# Altium project BGT60LTR11AIP_Shield_V2.0.PrjPcb
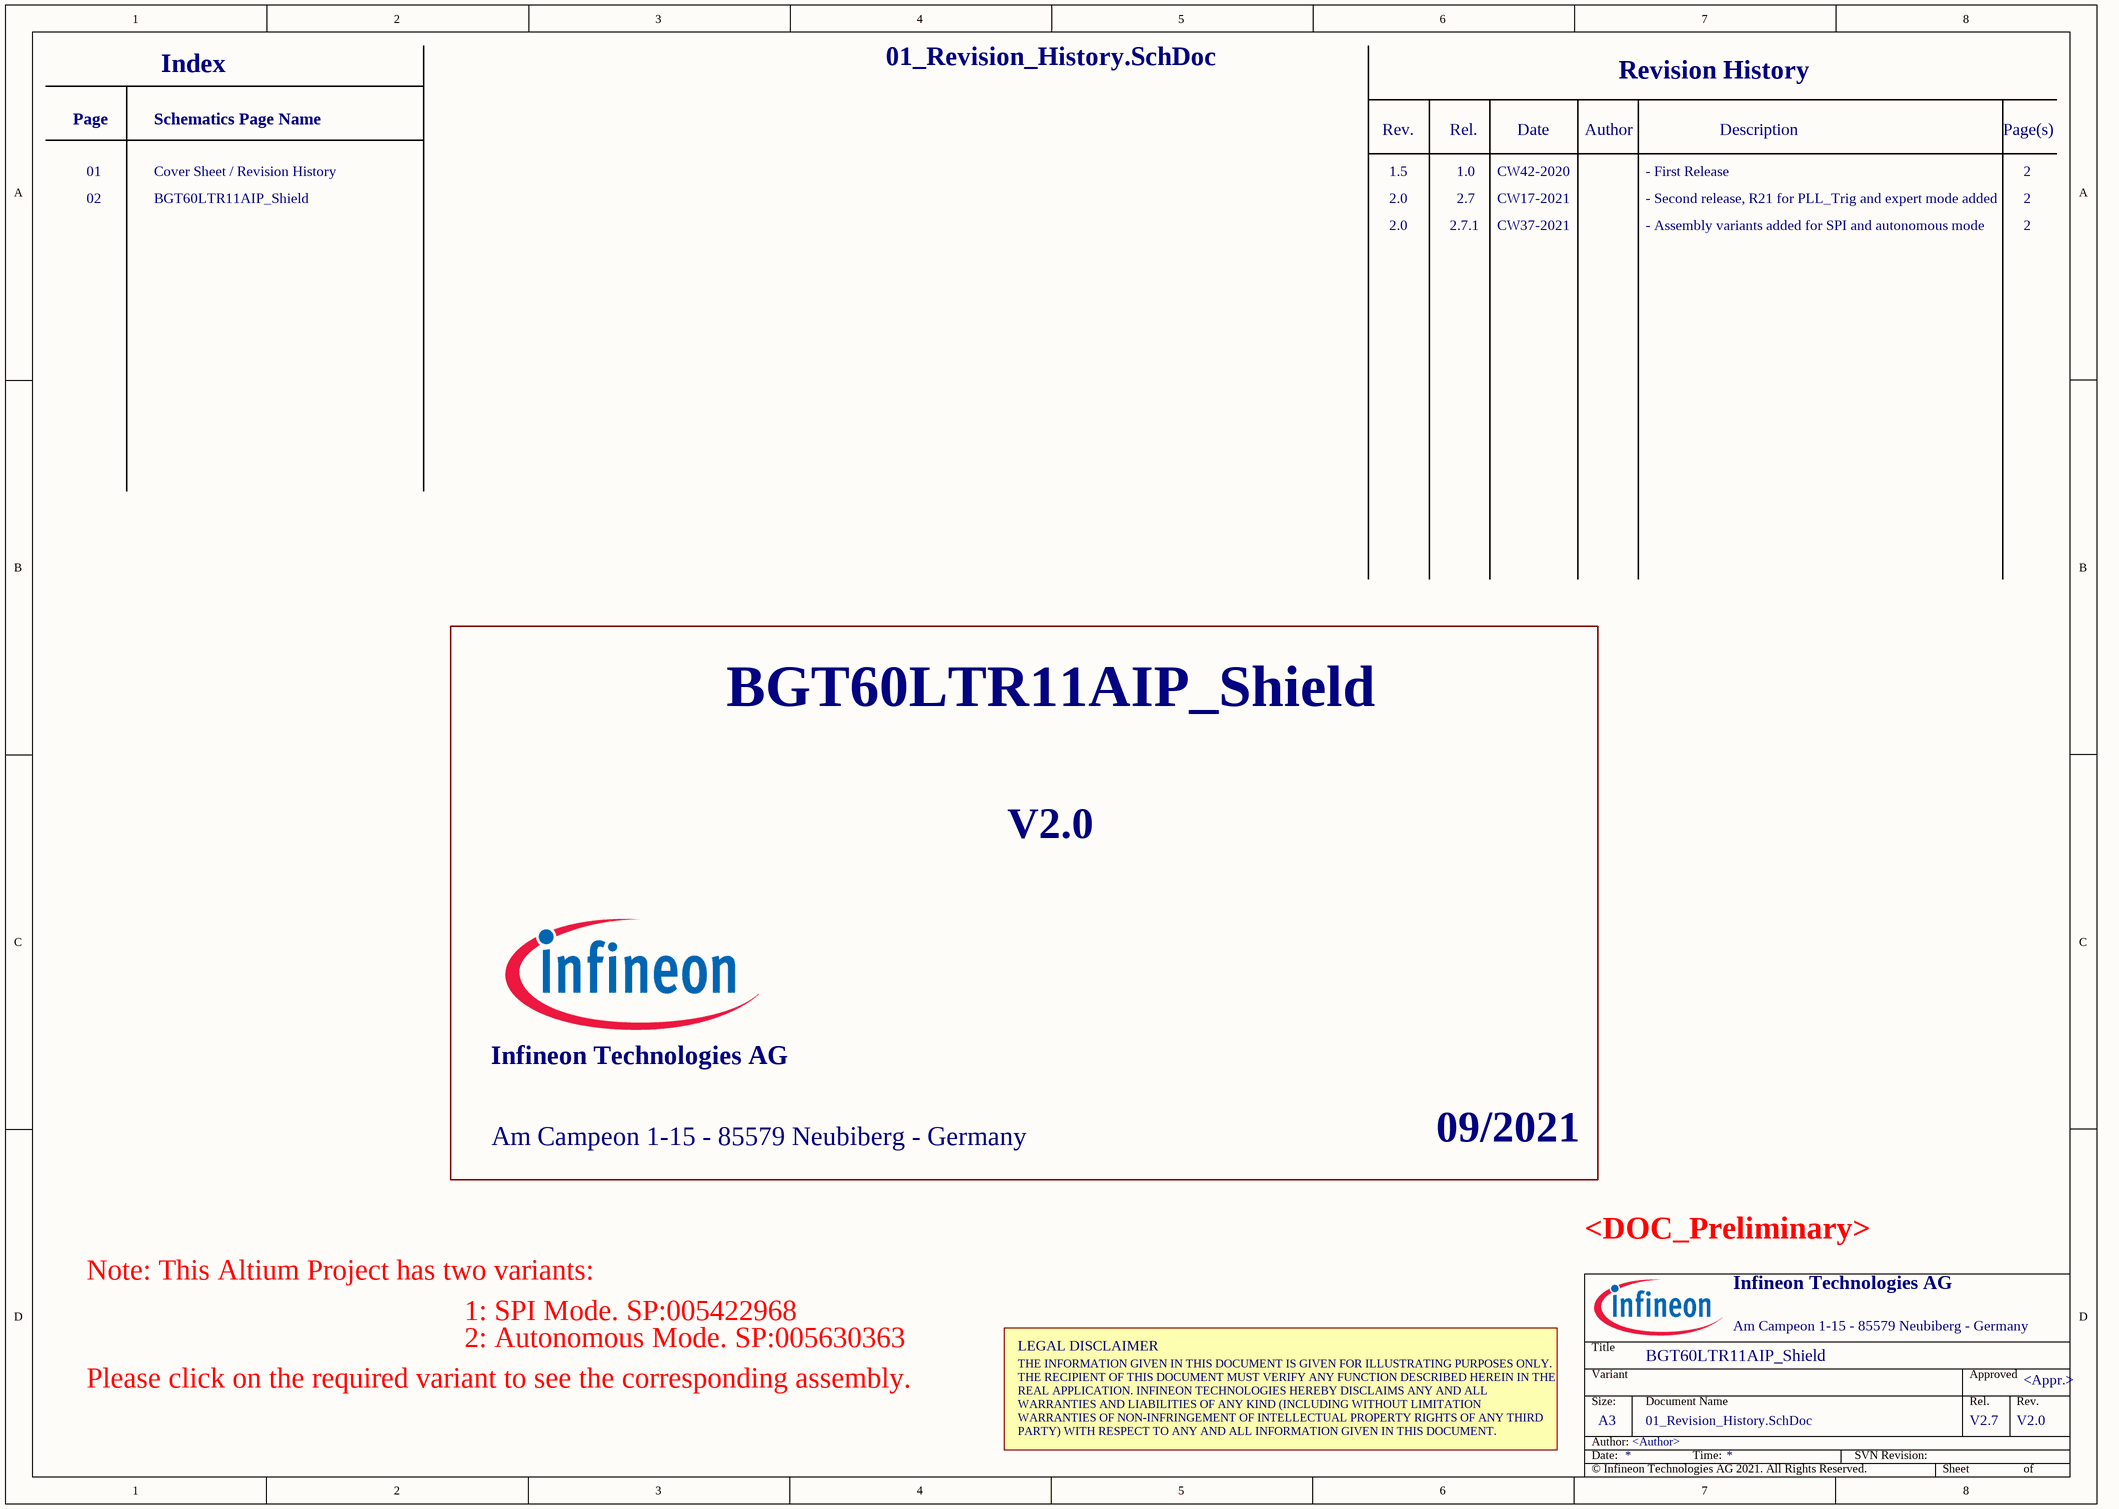
[diagram p0: 01_Revision_History.SchDoc]
PRJ_Address2: Am Campeon 1-15 - 85579 Neubiberg - Germany; PRJ_Copyright: © Infineon Technologies AG 2021. All Rights Reserved.; PRJ_Engineer: V2.7; PRJ_Organization: Infineon Technologies AG; PRJ_PCB_Release: V2.0; PRJ_PCB_Revision: V2.0; PRJ_PCBApprovedBy: <Appr.>; PRJ_PCBDesigner: <PCB Designer>; PRJ_Preliminary: <DOC_Preliminary>; PRJ_Release: V2.7.1; PRJ_Responsible: <Project Responsible>; PRJ_Revision: <Rev.>; PRJ_SCH_Author: <Author>; PRJ_SCH_Revision: V2.0; PRJ_Title: BGT60LTR11AIP_Shield; PRJ_Year: 09/2021
2 sheets, 64 parts. Net scope: global (net labels, ports and power ports of the same name join across sheets).
Board file: BGT60LTR11AIP_Shield_V2.0.PcbDoc
Sheets:
  01_Revision_History.SchDoc
  02_BGT60LTR11AIP_Shield.SchDoc

## Sheet 01_Revision_History.SchDoc: <Project Name>
size A3; ApprovedBy: <Appr.>; Author: <Author>; CompanyName: Infineon Technologies AG; Engineer: <Rel.>; Organization: Infineon Technologies AG; Address1: COM AC SDC SD3; Address2: Am Campeon 1-12  -  85579 Neubiberg  -  Germany; Address3: 85579 Neubiberg; Address4: Germany; Revision: <Rev.>; Release: RC00; PageSetup: Record=PageOptions|CenterHorizontal=True|CenterVertical=True|PrintScale=1.01|XCorrection=1.00|YCorrection=1.00|PrintKind=0|BorderSize=5000000|LeftOffset=0|BottomOffset=0|Orientation=2|PaperLength=1000|PaperWidth=1000|Scale=100|PaperSource=7|PrintQuality=-4|MediaType=1|DitherType=10|PaperKind=A3|PrintScaleMode=1; Doc_ConfidentialStatus: <Doc_ConfidentialStatus>; Doc_Preliminary: <Doc_Preliminary>

### Notes on the sheet
- Index
- Revision History
- Page
- 01
- Cover Sheet / Revision History
- Schematics Page Name
- Rev.
- 1.5
- Rel.
- 1.0
- CW42-2020
- Date
- Author
- - First Release
- Description
- Page(s)
- 2
- 02
- BGT60LTR11AIP_Shield
- 2.0
- 2.7.1
- 2.7
- CW17-2021
- CW37-2021
- - Second release, R21 for PLL_Trig and expert mode added
- - Assembly variants added for SPI and autonomous mode
- Note: This Altium Project has two variants:
- 1: SPI Mode. SP:005422968
- Please click on the required variant to see the corresponding assembly.
- 2: Autonomous Mode. SP:005630363
- LEGAL DISCLAIMER
- THE INFORMATION GIVEN IN THIS DOCUMENT IS GIVEN FOR ILLUSTRATING PURPOSES ONLY.
  THE RECIPIENT OF THIS DOCUMENT MUST VERIFY ANY FUNCTION DESCRIBED HEREIN IN THE
  REAL APPLICATION. INFINEON TECHNOLOGIES HEREBY DISCLAIMS ANY AND ALL
  WARRANTIES AND LIABILITIES OF ANY KIND (INCLUDING WITHOUT LIMITATION
  WARRANTIES OF NON-INFRINGEMENT OF INTELLECTUAL PROPERTY RIGHTS OF ANY THIRD
  PARTY) WITH RESPECT TO ANY AND ALL INFORMATION GIVEN IN THIS DOCUMENT.
- Title
- Variant
- Approved
- Date:
- Author:
- Size:
- A3
- Document Name
- Time:
- SVN Revision:
- Sheet
- of

## Sheet 02_BGT60LTR11AIP_Shield.SchDoc: <Project Name>
size A3; ApprovedBy: <Appr.>; Author: <Author>; CompanyName: Infineon Technologies AG; Engineer: <Rel.>; Organization: Infineon Technologies AG; Address1: COM AC SDC SD3; Address2: Am Campeon 1-12  -  85579 Neubiberg  -  Germany; Address3: 85579 Neubiberg; Address4: Germany; Revision: <Rev.>; Release: RC00; PageSetup: Record=PageOptions|CenterHorizontal=True|CenterVertical=True|PrintScale=1.01|XCorrection=1.00|YCorrection=1.00|PrintKind=0|BorderSize=5000000|LeftOffset=0|BottomOffset=0|Orientation=2|PaperLength=1000|PaperWidth=1000|Scale=100|PaperSource=7|PrintQuality=-4|MediaType=1|DitherType=10|PaperKind=A3|PrintScaleMode=1; Doc_ConfidentialStatus: <Doc_ConfidentialStatus>; Doc_Preliminary: <Doc_Preliminary>
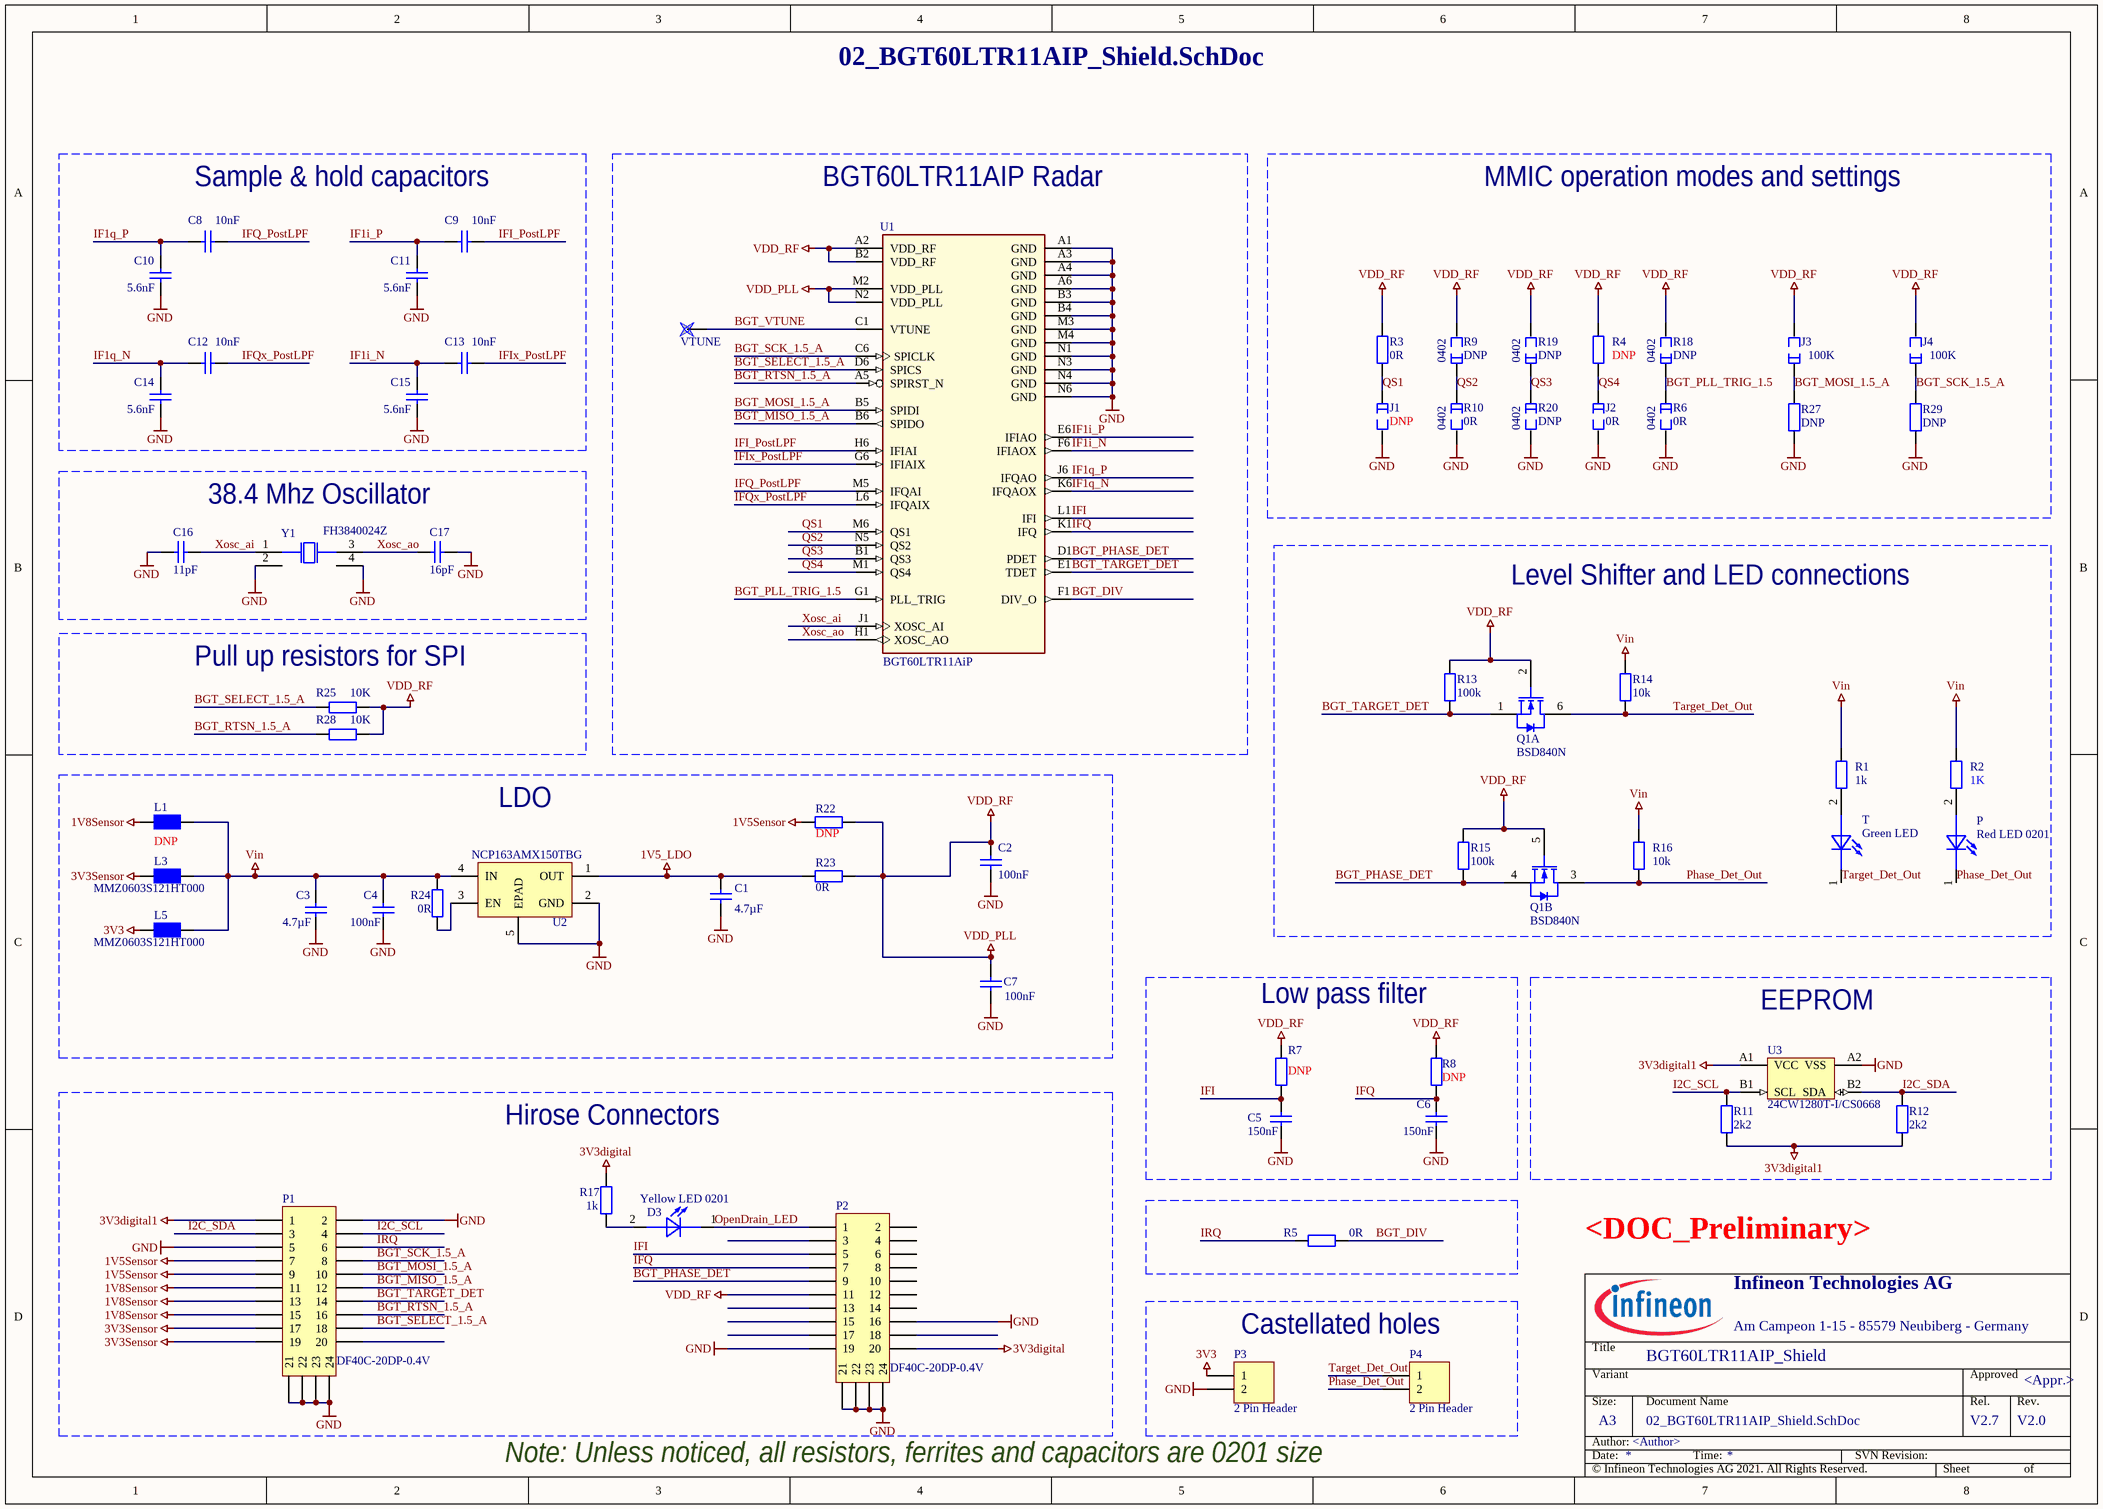
[diagram p1: 02_BGT60LTR11AIP_Shield.SchDoc]

### Parts
C1  4.7µF  [C_0201]
C2  100nF  [C_0201]
C3  4.7µF  [C_0201]
C4  100nF  [C_0201]
C5  150nF  [C_0201]
C6  150nF  [C_0201]
C7  100nF  [C_0201]
C8  10nF  [C_0201]
C9  10nF  [C_0201]
C10  5.6nF  [C_0201]
C11  5.6nF  [C_0201]
C12  10nF  [C_0201]
C13  10nF  [C_0201]
C14  5.6nF  [C_0201]
C15  5.6nF  [C_0201]
C16  11pF  [C_0201]
C17  16pF  [C_0201]
D3  Yellow LED 0201  [LED_0201]
J1  DNP  [QS_Jumper]
J2  0R  [QS_Jumper]
J3  100K  [QS_Jumper]
J4  100K  [QS_Jumper]
L1  DNP  [R_0201]
L3  MMZ0603S121HT000  [R_0201]
L5  MMZ0603S121HT000  [R_0201]
P  Red LED 0201  [LED_0201]
P1  DF40C-20DP-0.4V  [DF40C-20DP-0.4V]
P2  DF40C-20DP-0.4V  [DF40C-20DP-0.4V]
P3  2 Pin Header  [HDR1X2_Half]
P4  2 Pin Header  [HDR1X2_Half]
Q1  BSD840N  [INF-PG-SOT-363_N]  (parts A,B of 2)
R1  1k  [R_0201]
R2  1K  [R_0201]
R3  0R  [R_0201]
R4  DNP  [R_0201]
R5  0R  [R_0201]
R6  0R  value 0402  [RES_FastSolder_0402]
R7  DNP  [R_0201]
R8  DNP  [R_0201]
R9  DNP  value 0402  [RES_FastSolder_0402]
R10  0R  value 0402  [RES_FastSolder_0402]
R11  2k2  [R_0201]
R12  2k2  [R_0201]
R13  100k  [R_0201]
R14  10k  [R_0201]
R15  100k  [R_0201]
R16  10k  [R_0201]
R17  1k  [R_0201]
R18  DNP  value 0402  [RES_FastSolder_0402]
R19  DNP  value 0402  [RES_FastSolder_0402]
R20  DNP  value 0402  [RES_FastSolder_0402]
R22  DNP  [R_0201]
R23  0R  [R_0201]
R24  0R  [R_0201]
R25  10K  [R_0201]
R27  DNP  [R_0201]
R28  10K  [R_0201]
R29  DNP  [R_0201]
T  Green LED  [LED_0201]
U1  BGT60LTR11AiP  [BGA42N50P13X7_670X330X56_new]
U2  NCP163AMX150TBG  [NCP177]
U3  24CW1280T-I/CS0668  [WLCSP4 (CS0)]
VTUNE  Testpoint  [TP0.3MM]  (value not drawn)  (no BOM)
Y1  FH3840024Z  [NDK NX2520SA_NoBoarder]

### Nets
1V5_LDO: C1.2 R23.2 U2.1(OUT)
1V5Sensor: P1.7 P1.9 R22.2
1V8Sensor: L1.1 P1.11 P1.13 P1.15
3V3: L5.1 P3.1
3V3digital: P2.20 R17.2
3V3digital1: P1.1 R11.1 R12.1 U3.A1(VCC)
3V3Sensor: L3.1 P1.17 P1.19
GND: C1.1 C2.1 C3.1 C4.1 C5.2 C6.1 C7.1 C10.1 C11.1 C14.1 C15.1 C16.2 C17.1 J1.1 J2.1 P1.2 P1.5 P1.21 P1.22 P1.23 P1.24 P2.16 P2.19 P2.21 P2.22 P2.23 P2.24 P3.2 R6.1 R10.1 R20.1 R27.1 R29.1 U1.A1(GND) U1.A3(GND) U1.A4(GND) U1.A6(GND) U1.B3(GND) U1.B4(GND) U1.M3(GND) U1.M4(GND) U1.N1(GND) U1.N3(GND) U1.N4(GND) U1.N6(GND) U2.2(GND) U2.5(EPAD) U3.A2(VSS) Y1.2 Y1.4
VDD_PLL: C2.2 C7.2 J3.1 J4.1 P2.11 Q1.2(GATE) Q1.5(GATE) R3.2 R4.2 R7.2 R8.1 R9.1 R13.2 R15.2 R18.1 R19.1 R22.1 R23.1 R25.1 R28.1 U1.A2(VDD_RF) U1.B2(VDD_RF) U1.M2(VDD_PLL) U1.N2(VDD_PLL)  [also labelled VDD_RF]
Vin: C3.2 C4.2 L1.2 L3.2 L5.2 R1.2 R2.2 R14.2 R16.2 R24.2 U2.4(IN)
BGT_DIV: R5.1 U1.F1(DIV_O)
BGT_MISO_1.5_A: P1.12 U1.B6(SPIDO)
BGT_MOSI_1.5_A: J3.2 P1.10 R27.2 U1.B5(SPIDI)
BGT_PHASE_DET: P2.9 Q1.4(SOURCE) R15.1 U1.D1(PDET)
BGT_PLL_TRIG_1.5: R6.2 R18.2 U1.G1(PLL_TRIG)
BGT_RTSN_1.5_A: P1.16 R28.2 U1.A5(SPIRST_N)
BGT_SCK_1.5_A: J4.2 P1.8 R29.2 U1.C6(SPICLK)
BGT_SELECT_1.5_A: P1.18 R25.2 U1.D6(SPICS)
BGT_TARGET_DET: P1.14 Q1.1(SOURCE) R13.1 U1.E1(TDET)
BGT_VTUNE: U1.C1(VTUNE) VTUNE.1
I2C_SCL: P1.4 R11.2 U3.B1(SCL)
I2C_SDA: P1.3 R12.2 U3.B2(SDA)
IF1i_N: C13.1 C15.2 U1.F6(IFIAOX)
IF1i_P: C9.1 C11.2 U1.E6(IFIAO)
IF1q_N: C12.1 C14.2 U1.K6(IFQAOX)
IF1q_P: C8.1 C10.2 U1.J6(IFQAO)
IFI: C5.1 P2.5 R7.1 U1.L1(IFI)
IFI_PostLPF: C9.2 U1.H6(IFIAI)
IFIx_PostLPF: C13.2 U1.G6(IFIAIX)
IFQ: C6.2 P2.7 R8.2 U1.K1(IFQ)
IFQ_PostLPF: C8.2 U1.M5(IFQAI)
IFQx_PostLPF: C12.2 U1.L6(IFQAIX)
IRQ: P1.6 R5.2
OpenDrain_LED: D3.1(Cathode) P2.1
Phase_Det_Out: P.1(Cathode) P4.2 Q1.3(DRAIN) R16.1
QS1: J1.2 R3.1 U1.M6(QS1)
QS2: R9.2 R10.2 U1.N5(QS2)
QS3: R19.2 R20.2 U1.B1(QS3)
QS4: J2.2 R4.1 U1.M1(QS4)
Target_Det_Out: P4.1 Q1.6(DRAIN) R14.1 T.1(Cathode)
Xosc_ai: C16.1 U1.J1(XOSC_AI) Y1.1
Xosc_ao: C17.2 U1.H1(XOSC_AO) Y1.3
NetD3_2: D3.2(Anode) R17.1
NetP_2: P.2(Anode) R2.1
NetR1_1: R1.1 T.2(Anode)
NetR24_1: R24.1 U2.3(EN)

Not connected (* = marked no-connect by the designer): P1 20; P2 2 3 4 6 8 10 12 13 14 15 17 18

### Notes on the sheet
- Sample & hold capacitors
- BGT60LTR11AIP Radar
- MMIC operation modes and settings
- 38.4 Mhz Oscillator
- Level Shifter and LED connections
- (near R25) Pull up resistors for SPI
- LDO
- Low pass filter
- (near U3) EEPROM
- Hirose Connectors
- Castellated holes
- Note: Unless noticed, all resistors, ferrites and capacitors are 0201 size
- Title
- Variant
- Approved
- Date:
- Author:
- Size:
- A3
- Document Name
- Time:
- SVN Revision:
- Rel.
- Rev.
- Sheet
- of

### Library data of the parts
C1-C4 C7 C16 C17 = Cap: Capacitor; Value: 0201; Published: 8-Jun-2000; LatestRevisionDate: 17-Jul-2002; LatestRevisionNote: Re-released for DXP Platform.; PackageReference: RAD-0.3; Publisher: Altium Limited; PackageDescription: Radial Cap, Thru-Hole; 2 Leads; 0.3 in Pin Spacing
C5 C6 C8-C15 = Cap: Part Number: *
D3 = 392056: XZMYR155W; Legacy PartNumber: DIO00500016; Manufacturer: Rohm Semiconductors; Manufacturer Component Status: Active; Article Number: 392056; Version Number: V01; Value: 0201; Combined Parameters: Vf:2.9V;If:20mA;Ur:5V;Ir:100ÂµA;Pmax:66mW; Style: Single; Automotive Qualified: No; ComponentStatus: Released; Second Source allowed: Yes; Symbol Type: Standard LED Symbol, 1 Cathode, 2 Anode; Legacy DeviceID: DIO00500016; Part Type: Diode; Manufacturer Order Number: XZMYR155W; Type: LED; Application: Standard; Temperature min: -40; Temperature max: 85; Temperature Range: Industrial; RoHS Compliant: Y; PackageReference: 0201; ComponentLink1Description: Vendor WebSite; ComponentLink1URL: http://www.rohm.com; ComponentLink2Description: Datasheet; ComponentLink2URL: http://webnetprod.muc.infineon.com/pcbportal_prod/WorkFlows/AltiumComponent/StandardDocumentation?Versionid=392057; Supplier 1: Farnell; Supplier 2: DigiKey; Supplier Part Number 2: 1497-1299-1-ND; Supplier 3: Mouser
J1-J4 = QS_Jumper: 3 pads for QS pins configuration (soldering needed); Value: 0201
L1 L5 = INDUCTOR1: SMD Ferrite Bead; Preis: 0; Hersteller: Würth; FootprintBOM: 0805; Kleinmengendistributor: Digi-Key; KleinmengendistributorBestellnummer: 732-1601-1-ND
L3 = INDUCTOR1: Preis: 0; Hersteller: Würth; FootprintBOM: 0805; Kleinmengendistributor: Digi-Key; KleinmengendistributorBestellnummer: 732-1601-1-ND
P = 392056: XZMER155W; Manufacturer: Rohm Semiconductors; Manufacturer Component Status: Active; Version Number: V01; Combined Parameters: Vf:2.9V;If:20mA;Ur:5V;Ir:100ÂµA;Pmax:66mW; Style: Single; Automotive Qualified: No; ComponentStatus: Released; Second Source allowed: Yes; Symbol Type: Standard LED Symbol, 1 Cathode, 2 Anode; Part Type: Diode; Manufacturer Order Number: XZMER155W; Value: XZMER155W; Type: LED; Application: Standard; Temperature min: -40; Temperature max: 85; Temperature Range: Industrial; RoHS Compliant: Y; ComponentLink1Description: Vendor WebSite; ComponentLink1URL: http://www.rohm.com; ComponentLink2Description: Datasheet; ComponentLink2URL: http://webnetprod.muc.infineon.com/pcbportal_prod/WorkFlows/AltiumComponent/StandardDocumentation?Versionid=392057; Supplier 1: Farnell; Supplier 2: DigiKey; Supplier Part Number 2: 1497-1297-1-ND; Supplier 3: Mouser
P1 P2 = DF40C-20DP-0.4V: Hirose DF40C-20DS-0.4V - 61GHz side; System: Connector
P3 P4 = Header 2: Header, 2-Pin; LatestRevisionDate: 17-Jul-2002; LatestRevisionNote: Re-released for DXP Platform.; Publisher: Altium Limited
Q1 = BSD840N: N-Channel OptiMOS 2 Small-Signal-Transistor, 20 V VDS, 0.88 A ID, -55 to 150 degC, PG-SOT-363, Reel, Green; Manufacturer: Infineon; Green: TRUE; ID (max): 0.88 A; IDpuls (max): 3.5 A; Ptot (max): 0.5 W; QG: 0.26 nC; RDS (on) (max): 400 mOhm; RDS (on) (max) (@1.8V): 560 mOhm; RthJA (max): 250 K/W; VDS (max): 20 V; VGS(th) (max): 0.75 V; VGS(th) (min): 0.3 V; DatasheetVersion: Rev. 2.3; PackageVersion: Apr-08; PackageReference: PG-SOT-363; PackageDescription: 6-Pin Small Outline Transistor Package, 2 x 1.25 mm Body, 0.65 mm Pitch; Halogen-free: TRUE; Packing: Reel; RDS (on) (max) (@2.5V): 400 mOhm; Mounting Technology: Surface Mount; PartNumber: BSD840N; ComponentLink1Description: Manufacturer URL; ComponentLink1URL: http://www.infineon.com/; ComponentLink2Description: Datasheet; ComponentLink2URL: http://www.infineon.com/dgdl/BSD840N_Rev2.3_.pdf?folderId=db3a3043156fd573011622e10b5c1f67&fileId=db3a30431b0626df011b12b4486c7c02; ComponentLink3Description: Package Specification; ComponentLink3URL: http://www.infineon.com/dgdl/SOT363-Package_Overview.pdf?folderId=db3a30431936bc4b01195360bd8f3cdc&fileId=db3a30431936bc4b0119536b62bf3cf5
R1-R5 R7 R8 R11-R17 R22-R25 R27-R29 = Res2: Resistor; Value: 0201
R6 R9 R10 R18-R20 = RES_FS: Resistor
T = 392056: XZBGR155W5MAV; Manufacturer: Rohm Semiconductors; Manufacturer Component Status: Active; Article Number: 392056; Version Number: V01; Combined Parameters: Vf:2.9V;If:20mA;Ur:5V;Ir:100ÂµA;Pmax:66mW; Style: Single; Automotive Qualified: No; ComponentStatus: Released; Second Source allowed: Yes; Symbol Type: Standard LED Symbol, 1 Cathode, 2 Anode; Part Type: Diode; Manufacturer Order Number: XZBGR155W5MAV; Value: XZBGR155W5MAV; Type: LED; Application: Standard; Temperature min: -40; Temperature max: 85; Temperature Range: Industrial; RoHS Compliant: Y; PackageReference: 0201; ComponentLink1Description: Vendor WebSite; ComponentLink1URL: http://www.rohm.com; ComponentLink2Description: Datasheet; ComponentLink2URL: http://webnetprod.muc.infineon.com/pcbportal_prod/WorkFlows/AltiumComponent/StandardDocumentation?Versionid=392057; Supplier 1: Farnell; Supplier 2: DigiKey; Supplier Part Number 2: 1497-1295-1-ND; Supplier 3: Mouser
U1 = 595740: BGT60LTR11AiP, BGA 42 pins; Muliple Parts: No; Manufacturer: Infineon Technologies; Symbol Type: Low Power 60GHz Doppler Radar Sensor with Antenna; Article Number: 595740; Version Number: V01; Legacy DeviceID: IFX_BGT60LTR11AiP; Combined Parameters: - -;Vdc min/max:-;Iout:-;Fmax:-; PLMStatus: Not Recommended For New Designs; Second Source allowed: Yes; Voltage DC (max): na; Alternate View: No; Part Type: Integrated Circuit; Manufacturer Order Number: BGT60LTR11AiP; Value: BGT60LTR11AiP; Temperature Range: Military; ComponentLink1Description: Vendor WebSite; ComponentLink1URL: https://www.infineon.com/; ComponentLink2Description: Datasheet; ComponentLink2URL: http://webnetprod.muc.infineon.com/PCBPortal_Prod/WorkFlows/AltiumComponent/StandardDocumentation?Versionid=595741; Supplier 1: Farnell; Supplier 2: DigiKey; Supplier 3: Mouser; Package Description: BGA, SMD, 0.50 mm pitch, 42 pin, 3.30 mm X 6.70 mm X 0.552 mm H Body
U2 = NCP177: NCP163 - LDO 250mA, XDFN4, / ultra-low noise, high PSRR
U3 = 24CW128X: 128K I2C Serial EEPROM with Software Write Protection in CSP4 Package, 0.4mm Pin Pitch
VTUNE = P_PRUEFPAD: FootprintBOM: Testpoint; Preis: -
Y1 = 409657: Manufacturer: Nihon Dempa Kogyo; Manufacturer Component Status: Active; Symbol type: Standard Crystal Symbol, 4 Pins; Version Number: V01; Combined Parameters: Standard Standard Crystal; Style: Standard; Automotive Qualified: AEC Q200; ComponentStatus: Released; Second Source allowed: Yes; Part Type: Clock; Manufacturer Order Number: FH3840024Z; Value: FH3840024Z; Type: Crystal; Application: Standard; Temperature min: -30; Temperature max: 85; RoHS Compliant: Y; PackageReference: SMD 2.5 x 2 x 0.6mm; ComponentLink1Description: Vendor WebSite; ComponentLink1URL: http://www.ndk.com/en/; ComponentLink2Description: Datasheet; ComponentLink2URL: http://webnetprod.muc.infineon.com/pcbportal_prod/WorkFlows/AltiumComponent/StandardDocumentation?Versionid=409658; Supplier 1: Farnell; Supplier 2: DigiKey; Supplier Part Number 2: FH3840024ZCT-ND; Supplier 3: Mouser

## Assembly variants
Autonomous Mode: not fitted J1 J3 J4 L1 L3 P1 P2 R2 R3 R4 R5 R6 R7 R8 R11 R12 R17 R22 U3
SPI_mode: not fitted J1 L1 P3 P4 R4 R7 R8 R9 R18 R19 R20 R22 R27 R29